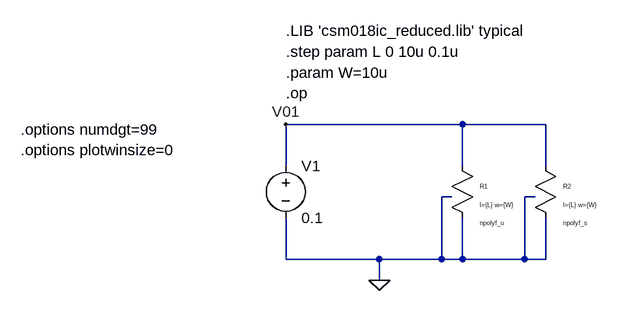
[diagram p0: schematic resistor2.asc]
resistor2.asc, the LTspice schematic file:
Version 4
SHEET 1 892 680
WIRE 352 112 80 112
WIRE 480 112 352 112
WIRE 80 176 80 112
WIRE 352 176 352 112
WIRE 480 176 480 112
WIRE 336 224 320 224
WIRE 464 224 448 224
WIRE 80 320 80 256
WIRE 224 320 80 320
WIRE 320 320 320 224
WIRE 320 320 224 320
WIRE 352 320 352 256
WIRE 352 320 320 320
WIRE 448 320 448 224
WIRE 448 320 352 320
WIRE 480 320 480 256
WIRE 480 320 448 320
WIRE 224 352 224 320
FLAG 224 352 0
FLAG 80 112 V01
SYMBOL voltage 80 160 R0
WINDOW 123 0 0 Left 0
WINDOW 39 0 0 Left 0
SYMATTR InstName V1
SYMATTR Value 0.1
SYMBOL res3 336 208 R0
WINDOW 3 43 25 Invisible 0
WINDOW 38 43 56 Left 0
WINDOW 123 43 28 Left 0
SYMATTR Value ""
SYMATTR SpiceModel npolyf_u
SYMATTR Value2 l={L} w={W}
SYMATTR InstName R1
SYMATTR Prefix X
SYMBOL res3 464 208 R0
WINDOW 3 43 25 Invisible 0
WINDOW 38 43 56 Left 0
WINDOW 123 43 28 Left 0
SYMATTR Value ""
SYMATTR SpiceModel npolyf_s
SYMATTR Value2 l={L} w={W}
SYMATTR InstName R2
SYMATTR Prefix X
TEXT 80 -32 Left 2 !.LIB 'csm018ic_reduced.lib' typical
TEXT 80 64 Left 2 !.op
TEXT -328 120 Left 2 !.options numdgt=99\n.options plotwinsize=0
TEXT 80 0 Left 2 !.step param L 0 10u 0.1u
TEXT 80 32 Left 2 !.param W=10u

The netlist it stands for:
* resistor2.asc
V1 V01 0 0.1
XR1 V01 0 0 npolyf_u l={L} w={W}  ; pins B A C
XR2 V01 0 0 npolyf_s l={L} w={W}  ; pins B A C
.LIB 'csm018ic_reduced.lib' typical
.op
.options numdgt=99
.options plotwinsize=0
.step param L 0 10u 0.1u
.param W=10u
.backanno
.end